# Altium schematic sheet ina219.SchDoc
size A2
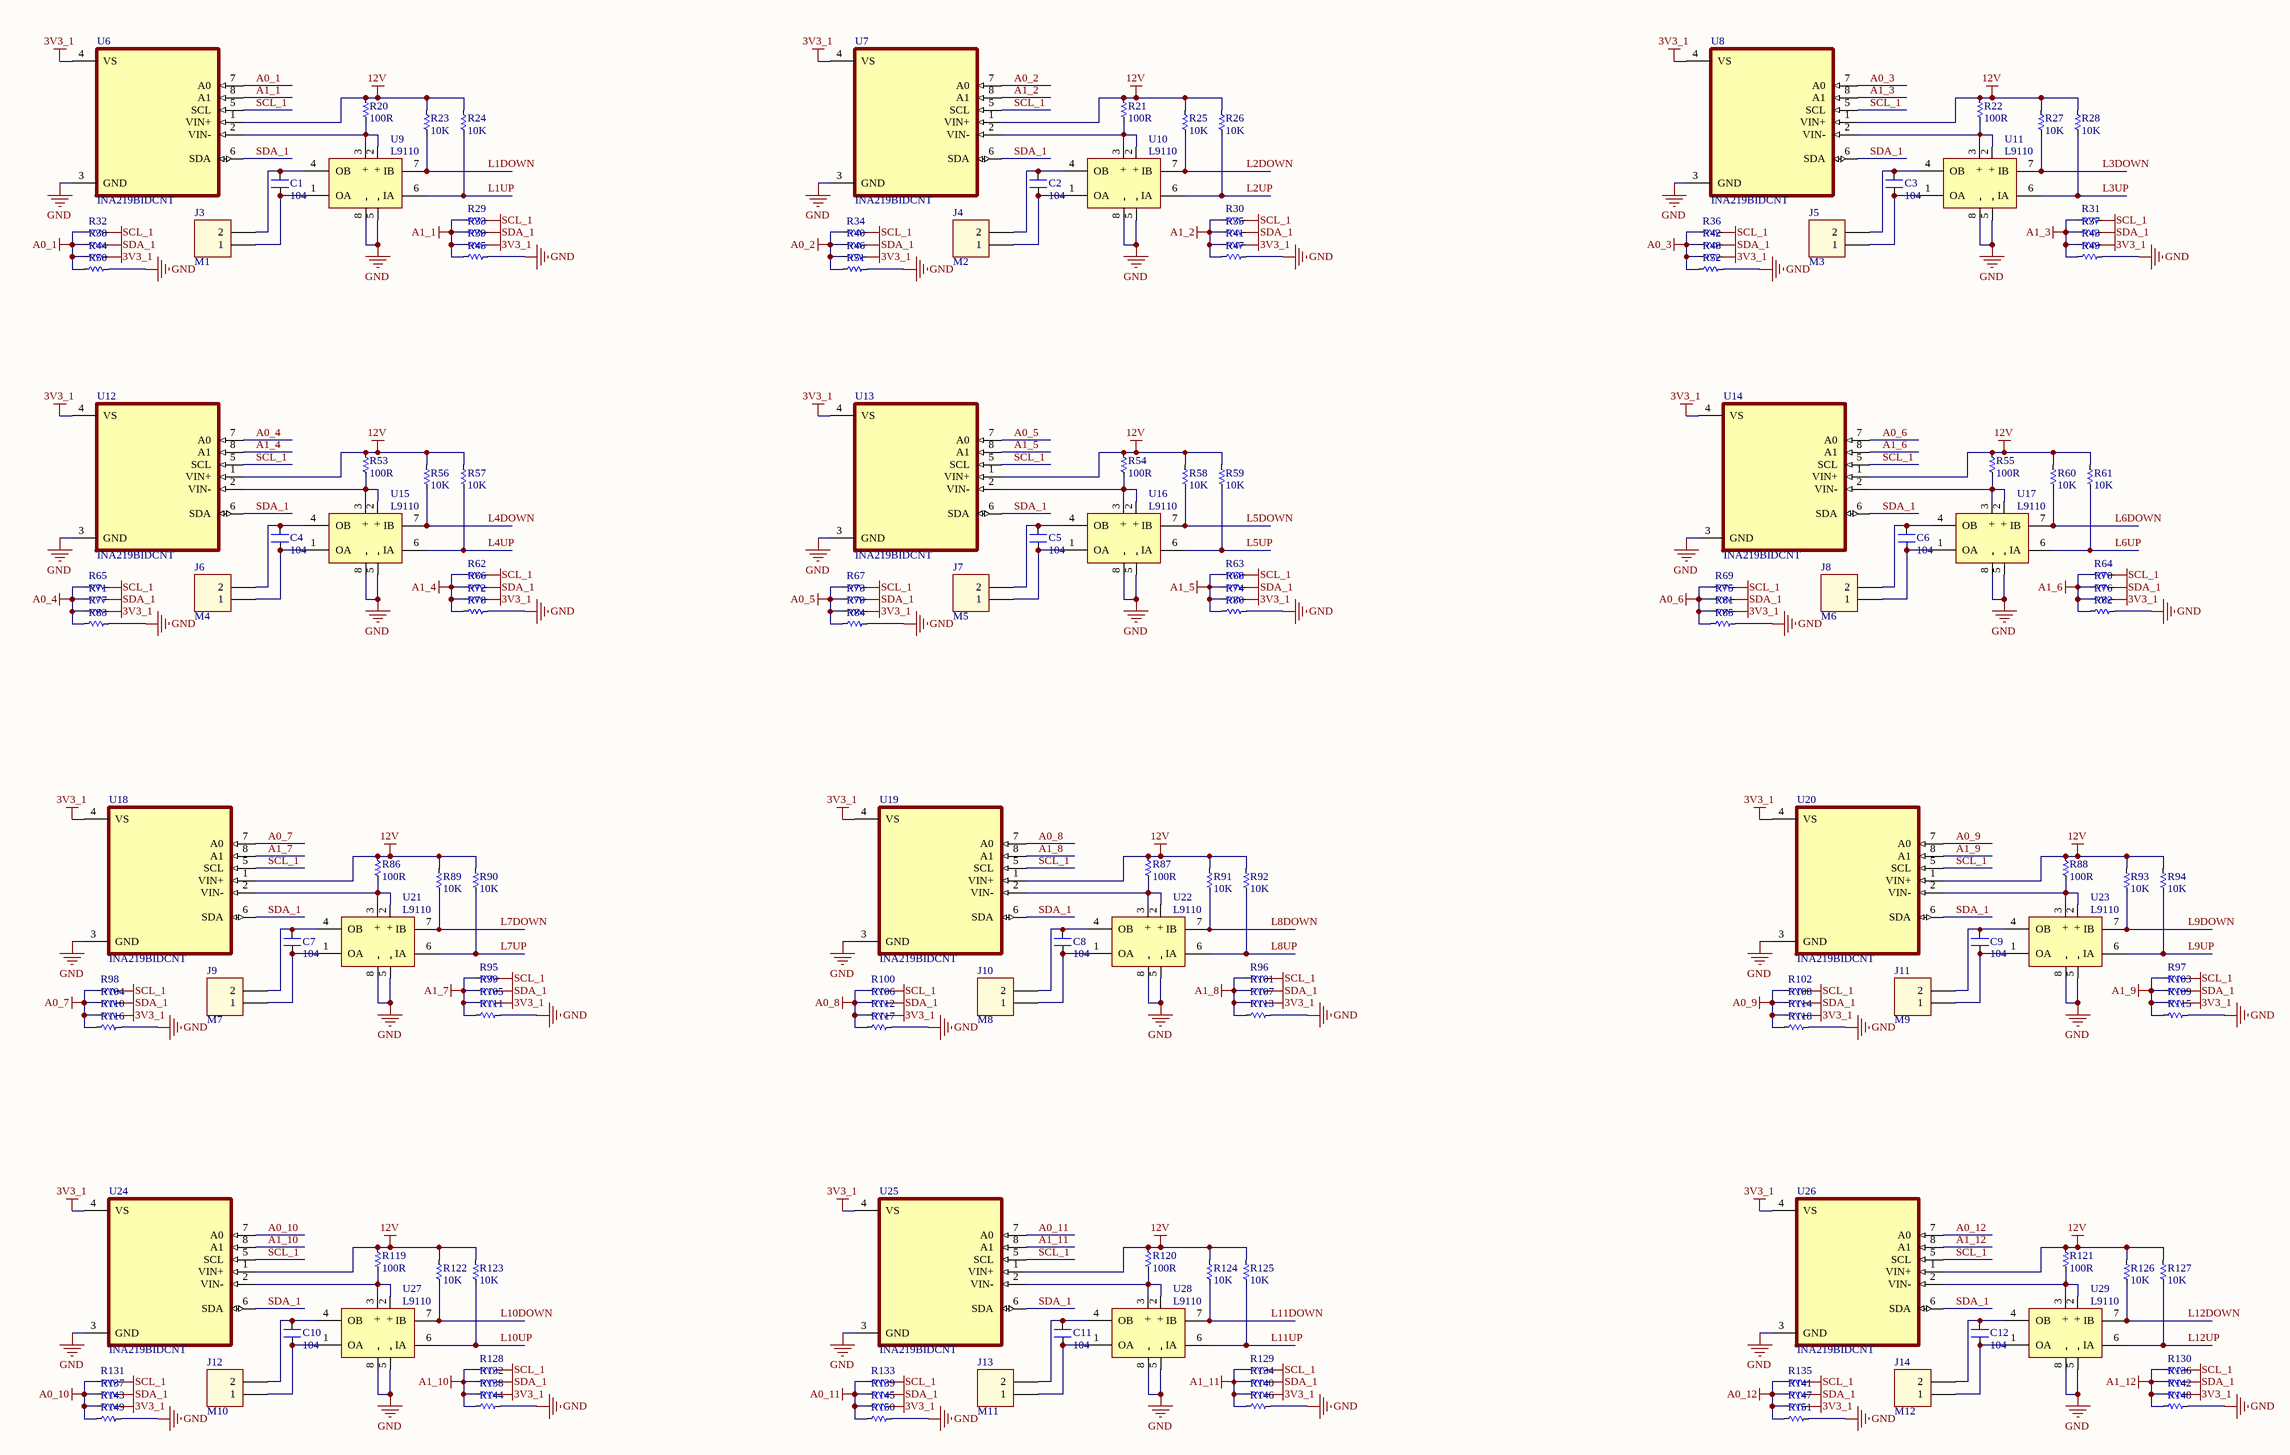
[diagram p0: ina219.SchDoc]

## Parts
C1  104  [SM-CAP-0805]
C2  104  [SM-CAP-0805]
C3  104  [SM-CAP-0805]
C4  104  [SM-CAP-0805]
C5  104  [SM-CAP-0805]
C6  104  [SM-CAP-0805]
C7  104  [SM-CAP-0805]
C8  104  [SM-CAP-0805]
C9  104  [SM-CAP-0805]
C10  104  [SM-CAP-0805]
C11  104  [SM-CAP-0805]
C12  104  [SM-CAP-0805]
J3  M1  [62000211622]
J4  M2  [62000211622]
J5  M3  [62000211622]
J6  M4  [62000211622]
J7  M5  [62000211622]
J8  M6  [62000211622]
J9  M7  [62000211622]
J10  M8  [62000211622]
J11  M9  [62000211622]
J12  M10  [62000211622]
J13  M11  [62000211622]
J14  M12  [62000211622]
R20  100R  [RES-SMD-2512]
R21  100R  [RES-SMD-2512]
R22  100R  [RES-SMD-2512]
R23  10K  [RES-SMD-0805]
R24  10K  [RES-SMD-0805]
R25  10K  [RES-SMD-0805]
R26  10K  [RES-SMD-0805]
R27  10K  [RES-SMD-0805]
R28  10K  [RES-SMD-0805]
R29  Res  [RES-SMD-0603]  (value not drawn)
R30  Res  [RES-SMD-0603]  (value not drawn)
R31  Res  [RES-SMD-0603]  (value not drawn)
R32  Res  [RES-SMD-0603]  (value not drawn)
R33  Res  [RES-SMD-0603]  (value not drawn)
R34  Res  [RES-SMD-0603]  (value not drawn)
R35  Res  [RES-SMD-0603]  (value not drawn)
R36  Res  [RES-SMD-0603]  (value not drawn)
R37  Res  [RES-SMD-0603]  (value not drawn)
R38  Res  [RES-SMD-0603]  (value not drawn)
R39  Res  [RES-SMD-0603]  (value not drawn)
R40  Res  [RES-SMD-0603]  (value not drawn)
R41  Res  [RES-SMD-0603]  (value not drawn)
R42  Res  [RES-SMD-0603]  (value not drawn)
R43  Res  [RES-SMD-0603]  (value not drawn)
R44  Res  [RES-SMD-0603]  (value not drawn)
R45  Res  [RES-SMD-0603]  (value not drawn)
R46  Res  [RES-SMD-0603]  (value not drawn)
R47  Res  [RES-SMD-0603]  (value not drawn)
R48  Res  [RES-SMD-0603]  (value not drawn)
R49  Res  [RES-SMD-0603]  (value not drawn)
R50  Res  [RES-SMD-0603]  (value not drawn)
R51  Res  [RES-SMD-0603]  (value not drawn)
R52  Res  [RES-SMD-0603]  (value not drawn)
R53  100R  [RES-SMD-2512]
R54  100R  [RES-SMD-2512]
R55  100R  [RES-SMD-2512]
R56  10K  [RES-SMD-0805]
R57  10K  [RES-SMD-0805]
R58  10K  [RES-SMD-0805]
R59  10K  [RES-SMD-0805]
R60  10K  [RES-SMD-0805]
R61  10K  [RES-SMD-0805]
R62  Res  [RES-SMD-0603]  (value not drawn)
R63  Res  [RES-SMD-0603]  (value not drawn)
R64  Res  [RES-SMD-0603]  (value not drawn)
R65  Res  [RES-SMD-0603]  (value not drawn)
R66  Res  [RES-SMD-0603]  (value not drawn)
R67  Res  [RES-SMD-0603]  (value not drawn)
R68  Res  [RES-SMD-0603]  (value not drawn)
R69  Res  [RES-SMD-0603]  (value not drawn)
R70  Res  [RES-SMD-0603]  (value not drawn)
R71  Res  [RES-SMD-0603]  (value not drawn)
R72  Res  [RES-SMD-0603]  (value not drawn)
R73  Res  [RES-SMD-0603]  (value not drawn)
R74  Res  [RES-SMD-0603]  (value not drawn)
R75  Res  [RES-SMD-0603]  (value not drawn)
R76  Res  [RES-SMD-0603]  (value not drawn)
R77  Res  [RES-SMD-0603]  (value not drawn)
R78  Res  [RES-SMD-0603]  (value not drawn)
R79  Res  [RES-SMD-0603]  (value not drawn)
R80  Res  [RES-SMD-0603]  (value not drawn)
R81  Res  [RES-SMD-0603]  (value not drawn)
R82  Res  [RES-SMD-0603]  (value not drawn)
R83  Res  [RES-SMD-0603]  (value not drawn)
R84  Res  [RES-SMD-0603]  (value not drawn)
R85  Res  [RES-SMD-0603]  (value not drawn)
R86  100R  [RES-SMD-2512]
R87  100R  [RES-SMD-2512]
R88  100R  [RES-SMD-2512]
R89  10K  [RES-SMD-0805]
R90  10K  [RES-SMD-0805]
R91  10K  [RES-SMD-0805]
R92  10K  [RES-SMD-0805]
R93  10K  [RES-SMD-0805]
R94  10K  [RES-SMD-0805]
R95  Res  [RES-SMD-0603]  (value not drawn)
R96  Res  [RES-SMD-0603]  (value not drawn)
R97  Res  [RES-SMD-0603]  (value not drawn)
R98  Res  [RES-SMD-0603]  (value not drawn)
R99  Res  [RES-SMD-0603]  (value not drawn)
R100  Res  [RES-SMD-0603]  (value not drawn)
R101  Res  [RES-SMD-0603]  (value not drawn)
R102  Res  [RES-SMD-0603]  (value not drawn)
R103  Res  [RES-SMD-0603]  (value not drawn)
R104  Res  [RES-SMD-0603]  (value not drawn)
R105  Res  [RES-SMD-0603]  (value not drawn)
R106  Res  [RES-SMD-0603]  (value not drawn)
R107  Res  [RES-SMD-0603]  (value not drawn)
R108  Res  [RES-SMD-0603]  (value not drawn)
R109  Res  [RES-SMD-0603]  (value not drawn)
R110  Res  [RES-SMD-0603]  (value not drawn)
R111  Res  [RES-SMD-0603]  (value not drawn)
R112  Res  [RES-SMD-0603]  (value not drawn)
R113  Res  [RES-SMD-0603]  (value not drawn)
R114  Res  [RES-SMD-0603]  (value not drawn)
R115  Res  [RES-SMD-0603]  (value not drawn)
R116  Res  [RES-SMD-0603]  (value not drawn)
R117  Res  [RES-SMD-0603]  (value not drawn)
R118  Res  [RES-SMD-0603]  (value not drawn)
R119  100R  [RES-SMD-2512]
R120  100R  [RES-SMD-2512]
R121  100R  [RES-SMD-2512]
R122  10K  [RES-SMD-0805]
R123  10K  [RES-SMD-0805]
R124  10K  [RES-SMD-0805]
R125  10K  [RES-SMD-0805]
R126  10K  [RES-SMD-0805]
R127  10K  [RES-SMD-0805]
R128  Res  [RES-SMD-0603]  (value not drawn)
R129  Res  [RES-SMD-0603]  (value not drawn)
R130  Res  [RES-SMD-0603]  (value not drawn)
R131  Res  [RES-SMD-0603]  (value not drawn)
R132  Res  [RES-SMD-0603]  (value not drawn)
R133  Res  [RES-SMD-0603]  (value not drawn)
R134  Res  [RES-SMD-0603]  (value not drawn)
R135  Res  [RES-SMD-0603]  (value not drawn)
R136  Res  [RES-SMD-0603]  (value not drawn)
R137  Res  [RES-SMD-0603]  (value not drawn)
R138  Res  [RES-SMD-0603]  (value not drawn)
R139  Res  [RES-SMD-0603]  (value not drawn)
R140  Res  [RES-SMD-0603]  (value not drawn)
R141  Res  [RES-SMD-0603]  (value not drawn)
R142  Res  [RES-SMD-0603]  (value not drawn)
R143  Res  [RES-SMD-0603]  (value not drawn)
R144  Res  [RES-SMD-0603]  (value not drawn)
R145  Res  [RES-SMD-0603]  (value not drawn)
R146  Res  [RES-SMD-0603]  (value not drawn)
R147  Res  [RES-SMD-0603]  (value not drawn)
R148  Res  [RES-SMD-0603]  (value not drawn)
R149  Res  [RES-SMD-0603]  (value not drawn)
R150  Res  [RES-SMD-0603]  (value not drawn)
R151  Res  [RES-SMD-0603]  (value not drawn)
U6  INA219BIDCNT  [SOT65P280X145-8N]
U7  INA219BIDCNT  [SOT65P280X145-8N]
U8  INA219BIDCNT  [SOT65P280X145-8N]
U9  L9110  [DIP8]
U10  L9110  [DIP8]
U11  L9110  [DIP8]
U12  INA219BIDCNT  [SOT65P280X145-8N]
U13  INA219BIDCNT  [SOT65P280X145-8N]
U14  INA219BIDCNT  [SOT65P280X145-8N]
U15  L9110  [DIP8]
U16  L9110  [DIP8]
U17  L9110  [DIP8]
U18  INA219BIDCNT  [SOT65P280X145-8N]
U19  INA219BIDCNT  [SOT65P280X145-8N]
U20  INA219BIDCNT  [SOT65P280X145-8N]
U21  L9110  [DIP8]
U22  L9110  [DIP8]
U23  L9110  [DIP8]
U24  INA219BIDCNT  [SOT65P280X145-8N]
U25  INA219BIDCNT  [SOT65P280X145-8N]
U26  INA219BIDCNT  [SOT65P280X145-8N]
U27  L9110  [DIP8]
U28  L9110  [DIP8]
U29  L9110  [DIP8]

## Nets
3V3_1: R39.1 R41.1 R43.1 R44.1 R46.1 R48.1 R72.1 R74.1 R76.1 R77.1 R79.1 R81.1 R105.1 R107.1 R109.1 R110.1 R112.1 R114.1 R138.1 R140.1 R142.1 R143.1 R145.1 R147.1 U6.4(VS) U7.4(VS) U8.4(VS) U12.4(VS) U13.4(VS) U14.4(VS) U18.4(VS) U19.4(VS) U20.4(VS) U24.4(VS) U25.4(VS) U26.4(VS)
12V: R20.1 R21.1 R22.1 R23.1 R24.1 R25.1 R26.1 R27.1 R28.1 R53.1 R54.1 R55.1 R56.1 R57.1 R58.1 R59.1 R60.1 R61.1 R86.1 R87.1 R88.1 R89.1 R90.1 R91.1 R92.1 R93.1 R94.1 R119.1 R120.1 R121.1 R122.1 R123.1 R124.1 R125.1 R126.1 R127.1 U6.1(VIN+) U7.1(VIN+) U8.1(VIN+) U12.1(VIN+) U13.1(VIN+) U14.1(VIN+) U18.1(VIN+) U19.1(VIN+) U20.1(VIN+) U24.1(VIN+) U25.1(VIN+) U26.1(VIN+)
A0_1: R32.2 R38.2 R44.2 R50.2 U6.7(A0)
A0_2: R34.2 R40.2 R46.2 R51.2 U7.7(A0)
A0_3: R36.2 R42.2 R48.2 R52.2 U8.7(A0)
A0_4: R65.2 R71.2 R77.2 R83.2 U12.7(A0)
A0_5: R67.2 R73.2 R79.2 R84.2 U13.7(A0)
A0_6: R69.2 R75.2 R81.2 R85.2 U14.7(A0)
A0_7: R98.2 R104.2 R110.2 R116.2 U18.7(A0)
A0_8: R100.2 R106.2 R112.2 R117.2 U19.7(A0)
A0_9: R102.2 R108.2 R114.2 R118.2 U20.7(A0)
A0_10: R131.2 R137.2 R143.2 R149.2 U24.7(A0)
A0_11: R133.2 R139.2 R145.2 R150.2 U25.7(A0)
A0_12: R135.2 R141.2 R147.2 R151.2 U26.7(A0)
A1_1: R29.2 R33.2 R39.2 R45.2 U6.8(A1)
A1_2: R30.2 R35.2 R41.2 R47.2 U7.8(A1)
A1_3: R31.2 R37.2 R43.2 R49.2 U8.8(A1)
A1_4: R62.2 R66.2 R72.2 R78.2 U12.8(A1)
A1_5: R63.2 R68.2 R74.2 R80.2 U13.8(A1)
A1_6: R64.2 R70.2 R76.2 R82.2 U14.8(A1)
A1_7: R95.2 R99.2 R105.2 R111.2 U18.8(A1)
A1_8: R96.2 R101.2 R107.2 R113.2 U19.8(A1)
A1_9: R97.2 R103.2 R109.2 R115.2 U20.8(A1)
A1_10: R128.2 R132.2 R138.2 R144.2 U24.8(A1)
A1_11: R129.2 R134.2 R140.2 R146.2 U25.8(A1)
A1_12: R130.2 R136.2 R142.2 R148.2 U26.8(A1)
GND: R45.1 R47.1 R49.1 R50.1 R51.1 R52.1 R78.1 R80.1 R82.1 R83.1 R84.1 R85.1 R111.1 R113.1 R115.1 R116.1 R117.1 R118.1 R144.1 R146.1 R148.1 R149.1 R150.1 R151.1 U6.3(GND) U7.3(GND) U8.3(GND) U9.5(-) U9.8(-) U10.5(-) U10.8(-) U11.5(-) U11.8(-) U12.3(GND) U13.3(GND) U14.3(GND) U15.5(-) U15.8(-) U16.5(-) U16.8(-) U17.5(-) U17.8(-) U18.3(GND) U19.3(GND) U20.3(GND) U21.5(-) U21.8(-) U22.5(-) U22.8(-) U23.5(-) U23.8(-) U24.3(GND) U25.3(GND) U26.3(GND) U27.5(-) U27.8(-) U28.5(-) U28.8(-) U29.5(-) U29.8(-)
SCL_1: R29.1 R30.1 R31.1 R32.1 R34.1 R36.1 R62.1 R63.1 R64.1 R65.1 R67.1 R69.1 R95.1 R96.1 R97.1 R98.1 R100.1 R102.1 R128.1 R129.1 R130.1 R131.1 R133.1 R135.1 U6.5(SCL) U7.5(SCL) U8.5(SCL) U12.5(SCL) U13.5(SCL) U14.5(SCL) U18.5(SCL) U19.5(SCL) U20.5(SCL) U24.5(SCL) U25.5(SCL) U26.5(SCL)
SDA_1: R33.1 R35.1 R37.1 R38.1 R40.1 R42.1 R66.1 R68.1 R70.1 R71.1 R73.1 R75.1 R99.1 R101.1 R103.1 R104.1 R106.1 R108.1 R132.1 R134.1 R136.1 R137.1 R139.1 R141.1 U6.6(SDA) U7.6(SDA) U8.6(SDA) U12.6(SDA) U13.6(SDA) U14.6(SDA) U18.6(SDA) U19.6(SDA) U20.6(SDA) U24.6(SDA) U25.6(SDA) U26.6(SDA)
L1DOWN: R23.2 U9.7(IB)
L1UP: R24.2 U9.6(IA)
L2DOWN: R25.2 U10.7(IB)
L2UP: R26.2 U10.6(IA)
L3DOWN: R27.2 U11.7(IB)
L3UP: R28.2 U11.6(IA)
L4DOWN: R56.2 U15.7(IB)
L4UP: R57.2 U15.6(IA)
L5DOWN: R58.2 U16.7(IB)
L5UP: R59.2 U16.6(IA)
L6DOWN: R60.2 U17.7(IB)
L6UP: R61.2 U17.6(IA)
L7DOWN: R89.2 U21.7(IB)
L7UP: R90.2 U21.6(IA)
L8DOWN: R91.2 U22.7(IB)
L8UP: R92.2 U22.6(IA)
L9DOWN: R93.2 U23.7(IB)
L9UP: R94.2 U23.6(IA)
L10DOWN: R122.2 U27.7(IB)
L10UP: R123.2 U27.6(IA)
L11DOWN: R124.2 U28.7(IB)
L11UP: R125.2 U28.6(IA)
L12DOWN: R126.2 U29.7(IB)
L12UP: R127.2 U29.6(IA)
NetC1_1: C1.1 J3.1 U9.1(OA)
NetC1_2: C1.2 J3.2 U9.4(OB)
NetC2_1: C2.1 J4.1 U10.1(OA)
NetC2_2: C2.2 J4.2 U10.4(OB)
NetC3_1: C3.1 J5.1 U11.1(OA)
NetC3_2: C3.2 J5.2 U11.4(OB)
NetC4_1: C4.1 J6.1 U15.1(OA)
NetC4_2: C4.2 J6.2 U15.4(OB)
NetC5_1: C5.1 J7.1 U16.1(OA)
NetC5_2: C5.2 J7.2 U16.4(OB)
NetC6_1: C6.1 J8.1 U17.1(OA)
NetC6_2: C6.2 J8.2 U17.4(OB)
NetC7_1: C7.1 J9.1 U21.1(OA)
NetC7_2: C7.2 J9.2 U21.4(OB)
NetC8_1: C8.1 J10.1 U22.1(OA)
NetC8_2: C8.2 J10.2 U22.4(OB)
NetC9_1: C9.1 J11.1 U23.1(OA)
NetC9_2: C9.2 J11.2 U23.4(OB)
NetC10_1: C10.1 J12.1 U27.1(OA)
NetC10_2: C10.2 J12.2 U27.4(OB)
NetC11_1: C11.1 J13.1 U28.1(OA)
NetC11_2: C11.2 J13.2 U28.4(OB)
NetC12_1: C12.1 J14.1 U29.1(OA)
NetC12_2: C12.2 J14.2 U29.4(OB)
NetR20_2: R20.2 U6.2(VIN-) U9.2(+) U9.3(+)
NetR21_2: R21.2 U7.2(VIN-) U10.2(+) U10.3(+)
NetR22_2: R22.2 U8.2(VIN-) U11.2(+) U11.3(+)
NetR53_2: R53.2 U12.2(VIN-) U15.2(+) U15.3(+)
NetR54_2: R54.2 U13.2(VIN-) U16.2(+) U16.3(+)
NetR55_2: R55.2 U14.2(VIN-) U17.2(+) U17.3(+)
NetR86_2: R86.2 U18.2(VIN-) U21.2(+) U21.3(+)
NetR87_2: R87.2 U19.2(VIN-) U22.2(+) U22.3(+)
NetR88_2: R88.2 U20.2(VIN-) U23.2(+) U23.3(+)
NetR119_2: R119.2 U24.2(VIN-) U27.2(+) U27.3(+)
NetR120_2: R120.2 U25.2(VIN-) U28.2(+) U28.3(+)
NetR121_2: R121.2 U26.2(VIN-) U29.2(+) U29.3(+)

## Library data of the parts
C1-C12 = CN: Value: 0,1uF/300V; Designed by: VanDungEvn
J3-J14 = 62000211622: WR-WTB 2.00mm Male Vertical Shrouded Header, 2p; Pin Number: 2; ComponentLink1Description: Manufacturer; ComponentLink1URL: http://www.we-online.de; ComponentLink2Description: Datasheet; ComponentLink2URL: http://katalog.we-online.de/em/datasheet/6200xx11622.pdf; Part Number: 62000211622; Published Date: June 2017; Publisher: Wurth Elektronik; Pitch: 2.00 mm
R20-R151 = Res-SMD: Resistor; Manufacturer: Generic Components; Class: Passive; Published: 08/06/2000; Publisher: Altium Hobart Technology Centre
U6-U8 U12-U14 U18-U20 U24-U26 = INA219BIDCNT: 26V, 12-bit, i2c output current/voltage/power monitor 8-SOT-23 -40 to 125; MF: Texas Instruments; Texas_Instruments-Purchase-URL: https://snapeda.com/shop?store=Texas+Instruments&id=420868; Package: SOT-23-8 Texas Instruments; Availability: Unavailable; SnapEDA_Link: https://www.snapeda.com/parts/INA219BIDCNT/Texas%20Instruments/view-part/420868/?ref=snap; Value: *; MP: INA219BIDCNT; Price: None
U9-U11 U15-U17 U21-U23 U27-U29 = L9110: Half-Bridge Driver